# Altium schematic sheet AD9777(3).SchDoc
size 420 x 297 mm
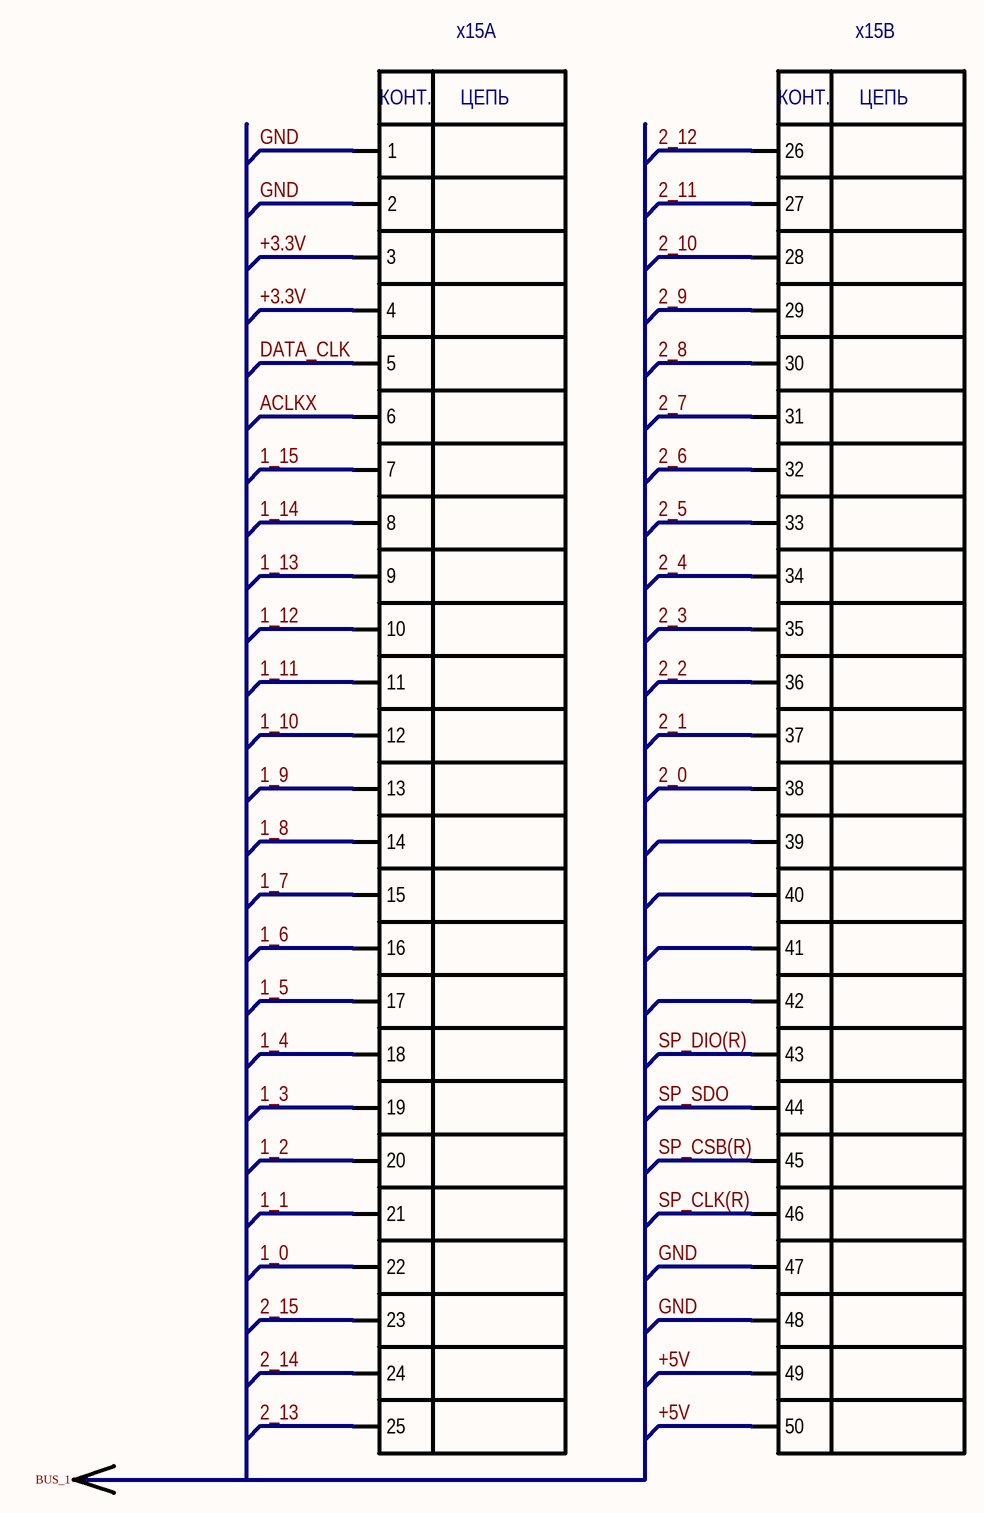
[diagram p0: AD9777(3).SchDoc]

## Parts
*?  VCC  (value not drawn)  (graphical)
x15  PBD-50  [PBD-50]  (value not drawn)  (parts A,B of 2)

## Nets
1_0: x15.22
1_1: x15.21
1_2: x15.20
1_3: x15.19
1_4: x15.18
1_5: x15.17
1_6: x15.16
1_7: x15.15
1_8: x15.14
1_9: x15.13
1_10: x15.12
1_11: x15.11
1_12: x15.10
1_13: x15.9
1_14: x15.8
1_15: x15.7
2_0: x15.38
2_1: x15.37
2_2: x15.36
2_3: x15.35
2_4: x15.34
2_5: x15.33
2_6: x15.32
2_7: x15.31
2_8: x15.30
2_9: x15.29
2_10: x15.28
2_11: x15.27
2_12: x15.26
2_13: x15.25
2_14: x15.24
2_15: x15.23
+3.3V: x15.3 x15.4
+5V: x15.49 x15.50
ACLKX: x15.6
DATA_CLK: x15.5
GND: x15.1 x15.2 x15.47 x15.48
SP_CLK(R): x15.46
SP_CSB(R): x15.45
SP_DIO(R): x15.43
SP_SDO: x15.44

Not connected (* = marked no-connect by the designer): x15 39 40 41 42

## Notes on the sheet
- Labels drawn without touching a wire or pin: BUS_1
- Подп. и дата
- Инв. № дубл.
- Взам. инв. №
- Инв. № подл.
- Лист
- Изм.
- № докум.
- Подп.
- Дата
- Копировал
- Формат А3
- (in symbol PBD-50, part A) КОНТ.; ЦЕПЬ
- (in symbol PBD-50, part B) КОНТ.; ЦЕПЬ

## Library data of the parts
*? = VCC: Порт ЕСКД. Для "наложения" на штатный Power Bar
x15 = PBD-50: Гнездо на плату шаг 2.54мм., двухрядные; ManufacturerPartNumber: PBD50; BCPId: *; Rem: *; Package: *; TU/GOST: *; Type: Вилка; HelpURL: *; Price: *